# EAGLE design RHD2164_headstage1 (EAGLE 7.2.0)
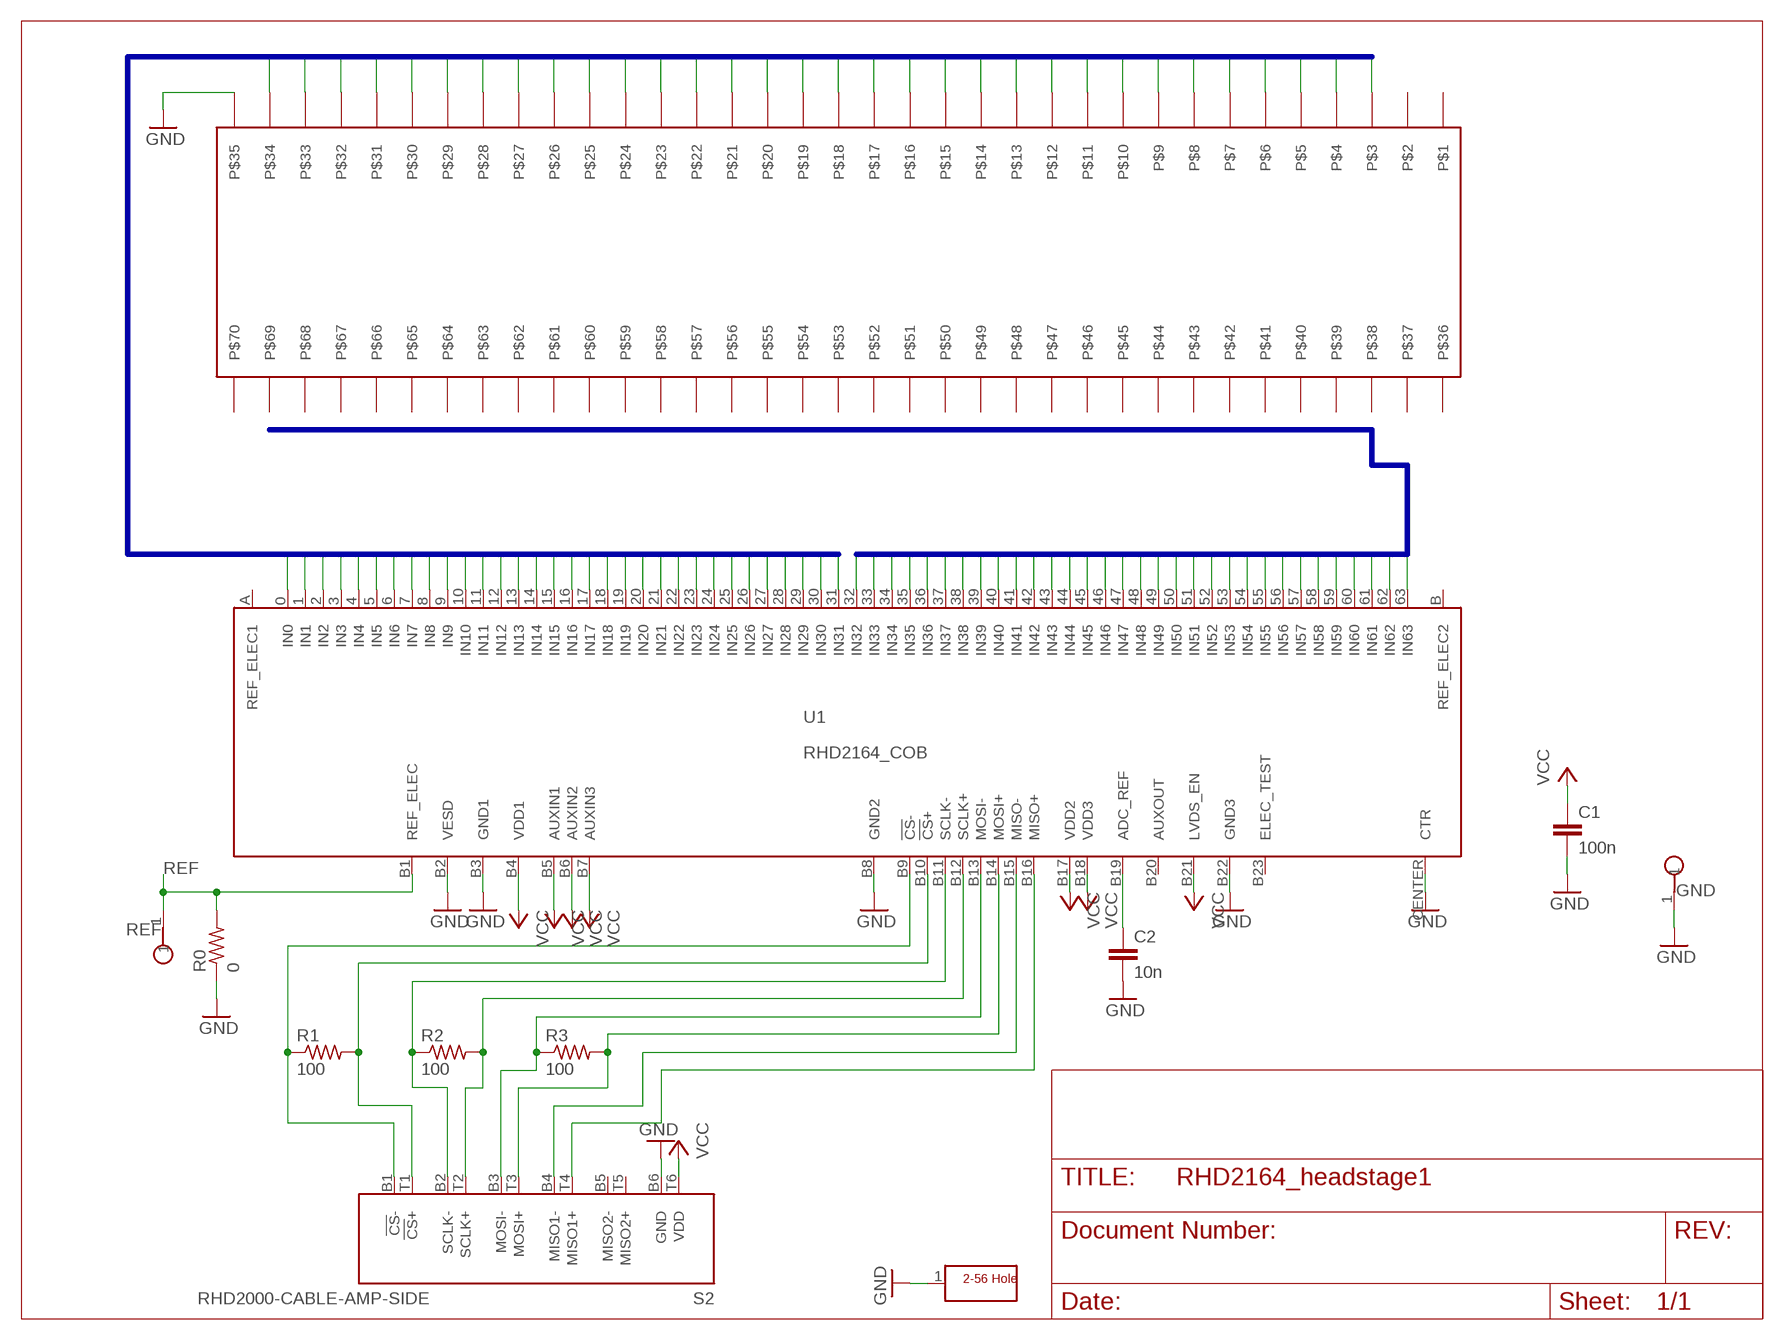
[diagram p0: schematic, sheet 1]

## Parts
C1  100n  C_0402  [0402]
C2  10n  C_0201  [0201]
GND  TESTPOINT_SMALL  [TESTPOINT_SMALL]
H1  SCREW_HOLE_2-56  [SCREW_HOLE_2-56]
R0  0  R_0402  [0402]
R1  100  R_0201  [0201]
R2  100  R_0201  [0201]
R3  100  R_0201  [0201]
REF  TESTPOINT_SMALL  [TESTPOINT_SMALL]
S2  RHD2000-CABLE-AMP-SIDE  [OMNETICS_PZN-12-AA]
U1  RHD2164_COB  [RHD2164_COB]
U$1  HIROSE_DF40_70PIN  [HIROSE_DF40C-70DS]

## Nets
A0: U1.0(IN0) U$1.P$3
A1: U1.1(IN1) U$1.P$4
A2: U1.2(IN2) U$1.P$5
A3: U1.3(IN3) U$1.P$6
A4: U1.4(IN4) U$1.P$7
A5: U1.5(IN5) U$1.P$8
A6: U1.6(IN6) U$1.P$9
A7: U1.7(IN7) U$1.P$10
A8: U1.8(IN8) U$1.P$11
A9: U1.9(IN9) U$1.P$12
A10: U1.10(IN10) U$1.P$13
A11: U1.11(IN11) U$1.P$14
A12: U1.12(IN12) U$1.P$15
A13: U1.13(IN13) U$1.P$16
A14: U1.14(IN14) U$1.P$17
A15: U1.15(IN15) U$1.P$18
A16: U1.16(IN16) U$1.P$19
A17: U1.17(IN17) U$1.P$20
A18: U1.18(IN18) U$1.P$21
A19: U1.19(IN19) U$1.P$22
A20: U1.20(IN20) U$1.P$23
A21: U1.21(IN21) U$1.P$24
A22: U1.22(IN22) U$1.P$25
A23: U1.23(IN23) U$1.P$26
A24: U1.24(IN24) U$1.P$27
A25: U1.25(IN25) U$1.P$28
A26: U1.26(IN26) U$1.P$29
A27: U1.27(IN27) U$1.P$30
A28: U1.28(IN28) U$1.P$31
A29: U1.29(IN29) U$1.P$32
A30: U1.30(IN30) U$1.P$33
A31: U1.31(IN31) U$1.P$34
B0: U1.32(IN32)
B1: U1.33(IN33)
B2: U1.34(IN34)
B3: U1.35(IN35)
B4: U1.36(IN36)
B5: U1.37(IN37)
B6: U1.38(IN38)
B7: U1.39(IN39)
B8: U1.40(IN40)
B9: U1.41(IN41)
B10: U1.42(IN42)
B11: U1.43(IN43)
B12: U1.44(IN44)
B13: U1.45(IN45)
B14: U1.46(IN46)
B15: U1.47(IN47)
B16: U1.48(IN48)
B17: U1.49(IN49)
B18: U1.50(IN50)
B19: U1.51(IN51)
B20: U1.52(IN52)
B21: U1.53(IN53)
B22: U1.54(IN54)
B23: U1.55(IN55)
B24: U1.56(IN56)
B25: U1.57(IN57)
B26: U1.58(IN58)
B27: U1.59(IN59)
B28: U1.60(IN60)
B29: U1.61(IN61)
B30: U1.62(IN62)
B31: U1.63(IN63)
GND [thick]: C1.2 C2.2 GND.1 H1.1 R0.1 S2.B6(GND) U1.B2(VESD) U1.B3(GND1) U1.B8(GND2) U1.B22(GND3) U1.CENTER(CTR) U$1.P$35
N$1: S2.T4(MISO1+) U1.B16(MISO+)
N$11: R1.1 S2.B1(!CS!-) U1.B9(!CS!-)
N$35: R1.2 S2.T1(!CS!+) U1.B10(!CS!+)
N$36: R2.1 S2.B2(SCLK-) U1.B11(SCLK-)
N$37: R2.2 S2.T2(SCLK+) U1.B12(SCLK+)
N$38: R3.1 S2.B3(MOSI-) U1.B13(MOSI-)
N$39: R3.2 S2.T3(MOSI+) U1.B14(MOSI+)
N$40: S2.B4(MISO1-) U1.B15(MISO-)
N$42 [thick]: C2.1 U1.B19(ADC_REF)
REF [thick]: R0.2 REF.1 U1.B1(REF_ELEC)
VCC [thick]: C1.1 S2.T6(VDD) U1.B4(VDD1) U1.B5(AUXIN1) U1.B6(AUXIN2) U1.B7(AUXIN3) U1.B17(VDD2) U1.B18(VDD3) U1.B21(LVDS_EN)
Unconnected: S2.B5(MISO2-) S2.T5(MISO2+) U1.A(REF_ELEC1) U1.B20(AUXOUT) U1.B23(ELEC_TEST) U1.B(REF_ELEC2) U$1.P$1 U$1.P$2 U$1.P$36 U$1.P$37 U$1.P$38 U$1.P$39 U$1.P$40 U$1.P$41 U$1.P$42 U$1.P$43 U$1.P$44 U$1.P$45 U$1.P$46 U$1.P$47 U$1.P$48 U$1.P$49 U$1.P$50 U$1.P$51 U$1.P$52 U$1.P$53 U$1.P$54 U$1.P$55 U$1.P$56 U$1.P$57 U$1.P$58 U$1.P$59 U$1.P$60 U$1.P$61 U$1.P$62 U$1.P$63 U$1.P$64 U$1.P$65 U$1.P$66 U$1.P$67 U$1.P$68 U$1.P$69 U$1.P$70

## Buses
A[0..31]
B[0..31]

## Library data of the parts
C1 C2 = RHD2000_eval_board:C: Capacitor
GND REF = RHD2000_eval_board:TESTPOINT: PCB Test Point
H1 = RHD2000_eval_board:SCREW_HOLE_2-56: Mounting hole
R0 R1-R3 = RHD2000_eval_board:R: Resistor
S2 = RHD2000:RHD2000-CABLE-AMP-SIDE
U1 = RHD2000:RHD2164
U$1 = GG_hirose70:HIROSE_DF40_70PIN

## Net classes
1 thick: width 0.102 mm
2 power: width 0.61 mm

## Board
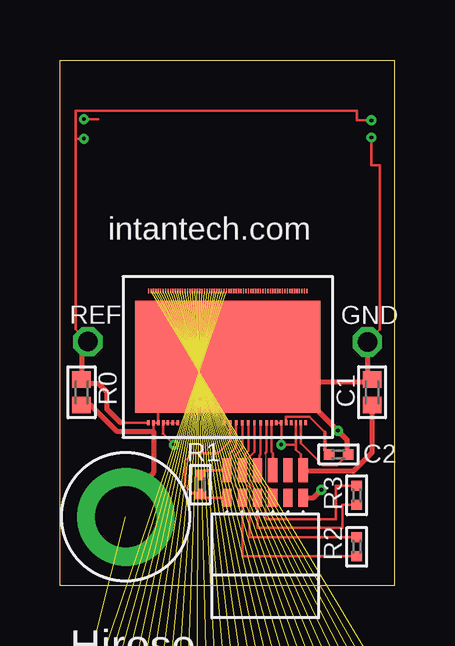
[diagram p1: board, top side]
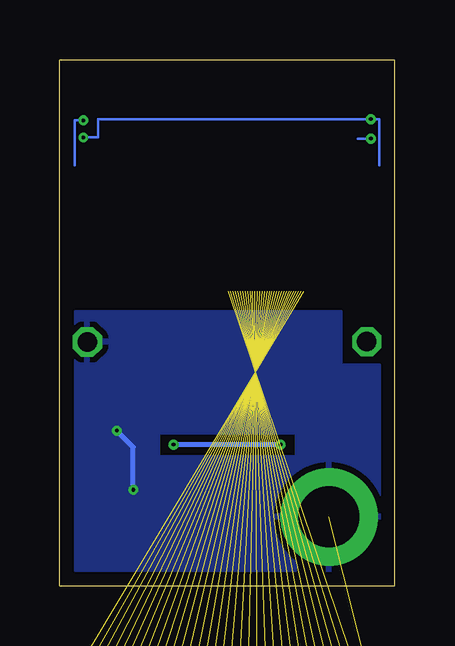
[diagram p2: board, bottom side, seen from below]

Size 13.97 x 21.91 mm. Coordinates in mm from the lower left corner, seen from the top.
Outline: 0,0 0,21.91 13.97,21.91 13.97,0 0,0
Copper layers (1*16): Top 0.035mm / dielectric 1.5mm / Bottom 0.035mm
Design rules "default": minimum track width 2mil, minimum drill 6mil, track to track 2mil, track to pad 2mil, pad to pad 2mil, via to via 2mil, smd to smd 2mil, copper to edge 20mil, drill to drill 15mil, minimum pad ring 5mil, minimum via ring 5mil, stop-mask expansion 2mil, vias tented up to drill 0mil, thermal gap 10mil
tRestrict: area 6.9,6.6 to 7,6.9; area 7.2,6.6 to 7.3,6.9; area 7.5,6.6 to 7.5,6.9; area 7.7,6.6 to 7.8,6.9; area 8,6.6 to 8,6.9; area 8.2,6.6 to 8.3,6.9

### Footprints (pad centres in the part's own frame; a part is rotated, then mirrored left to right if it is on the bottom)
0402 = smd 0.686 x 0.762: 1 -0.533,0; 2 0.533,0
0201 = smd 0.432 x 0.432: 1 -0.394,0; 2 0.394,0
TESTPOINT_SMALL = drill 0.813 octagon: 1 0,0
SCREW_HOLE_2-56 = drill 2.54 pad 4.064: 1 0,0
OMNETICS_PZN-12-AA = smd 0.381 x 0.762: B1 1.587,-1.016; B2 0.953,-1.016; B3 0.318,-1.016; B4 -0.318,-1.016; B5 -0.953,-1.016; B6 -1.587,-1.016 | smd 0.381 x 1.016: T1 1.587,-2.159; T2 0.953,-2.159; T3 0.318,-2.159; T4 -0.318,-2.159; T5 -0.953,-2.159; T6 -1.587,-2.159
RHD2164_COB = smd 0.051 x 0.203: 0 -3.2,2.743; 1 -3.099,2.743; 2 -2.997,2.743; 3 -2.896,2.743; 4 -2.794,2.743; 5 -2.692,2.743; 6 -2.591,2.743; 7 -2.489,2.743; 8 -2.388,2.743; 9 -2.286,2.743; 10 -2.184,2.743; 11 -2.083,2.743; 12 -1.981,2.743; 13 -1.88,2.743; 14 -1.778,2.743; 15 -1.676,2.743; 16 -1.575,2.743; 17 -1.473,2.743; 18 -1.372,2.743; 19 -1.27,2.743; 20 -1.168,2.743; 21 -1.067,2.743; 22 -0.965,2.743; 23 -0.864,2.743; 24 -0.762,2.743; 25 -0.66,2.743; 26 -0.559,2.743; 27 -0.457,2.743; 28 -0.356,2.743; 29 -0.254,2.743; 30 -0.152,2.743; 31 -0.051,2.743; 32 0.051,2.743; 33 0.152,2.743; 34 0.254,2.743; 35 0.356,2.743; 36 0.457,2.743; 37 0.559,2.743; 38 0.66,2.743; 39 0.762,2.743; 40 0.864,2.743; 41 0.965,2.743; 42 1.067,2.743; 43 1.168,2.743; 44 1.27,2.743; 45 1.372,2.743; 46 1.473,2.743; 47 1.575,2.743; 48 1.676,2.743; 49 1.778,2.743; 50 1.88,2.743; 51 1.981,2.743; 52 2.083,2.743; 53 2.184,2.743; 54 2.286,2.743; 55 2.388,2.743; 56 2.489,2.743; 57 2.591,2.743; 58 2.692,2.743; 59 2.794,2.743; 60 2.896,2.743; 61 2.997,2.743; 62 3.099,2.743; 63 3.2,2.743; A -3.302,2.743; B 3.302,2.743 | smd 0.102 x 0.203: B1 -3.302,-2.743; B2 -3.099,-2.743; B3 -2.896,-2.743; B4 -2.692,-2.743; B5 -2.489,-2.743; B6 -2.286,-2.743; B7 -2.083,-2.743; B8 -0.152,-2.743; B9 0.102,-2.743; B10 0.356,-2.743; B11 0.61,-2.743; B12 0.864,-2.743; B13 1.118,-2.743; B14 1.372,-2.743; B15 1.626,-2.743; B16 1.829,-2.743; B17 2.032,-2.743; B18 2.235,-2.743; B19 2.438,-2.743; B20 2.642,-2.743; B21 2.845,-2.743; B22 3.048,-2.743; B23 3.251,-2.743 | smd 7.722 x 4.674: CENTER 0,0
HIROSE_DF40C-70DS = smd 0.2 x 0.7: P$1 0,0; P$2 -0.4,0; P$3 -0.8,0; P$4 -1.2,0; P$5 -1.6,0; P$6 -2,0; P$7 -2.4,0; P$8 -2.8,0; P$9 -3.2,0; P$10 -3.6,0; P$11 -4,0; P$12 -4.4,0; P$13 -4.8,0; P$14 -5.2,0; P$15 -5.6,0; P$16 -6,0; P$17 -6.4,0; P$18 -6.8,0; P$19 -7.2,0; P$20 -7.6,0; P$21 -8,0; P$22 -8.4,0; P$23 -8.8,0; P$24 -9.2,0; P$25 -9.6,0; P$26 -10,0; P$27 -10.4,0; P$28 -10.8,0; P$29 -11.2,0; P$30 -11.6,0; P$31 -12,0; P$32 -12.4,0; P$33 -12.8,0; P$34 -13.2,0; P$35 -13.6,0; P$36 0,-3.08; P$37 -0.42,-3.08; P$38 -0.82,-3.08; P$39 -1.22,-3.08; P$40 -1.62,-3.08; P$41 -2.02,-3.08; P$42 -2.42,-3.08; P$43 -2.82,-3.08; P$44 -3.22,-3.08; P$45 -3.62,-3.08; P$46 -4.02,-3.08; P$47 -4.42,-3.08; P$48 -4.82,-3.08; P$49 -5.22,-3.08; P$50 -5.62,-3.08; P$51 -6.02,-3.08; P$52 -6.42,-3.08; P$53 -6.82,-3.08; P$54 -7.22,-3.08; P$55 -7.62,-3.08; P$56 -8.02,-3.08; P$57 -8.42,-3.08; P$58 -8.82,-3.08; P$59 -9.22,-3.08; P$60 -9.62,-3.08; P$61 -10.02,-3.08; P$62 -10.42,-3.08; P$63 -10.82,-3.08; P$64 -11.22,-3.08; P$65 -11.62,-3.08; P$66 -12.02,-3.08; P$67 -12.42,-3.08; P$68 -12.82,-3.08; P$69 -13.22,-3.08; P$70 -13.62,-3.08

### Placement (x,y rotation side)
C1  13.02,8.06 90 top
C2  11.62,5.47 0 top
GND  12.83,10.16 0 top
H1  2.74,2.87 0 top
R0  0.9,8.06 90 top
R1  5.85,4.22 90 top
R2  12.38,1.63 90 top
R3  12.38,3.77 90 top
REF  1.17,10.17 0 top
S2  8.56,2.65 180 top
U1  7,9.54 0 top
U$1  14.53,-4.32 0 top  (outside the outline)

### Tracks (layer width: path | path; a pad name or v marks a point on that pad's centre or on a via)
A0  (1 unrouted)
A1  (1 unrouted)
A2  (1 unrouted)
A3  (1 unrouted)
A4  (1 unrouted)
A5  (1 unrouted)
A6  (1 unrouted)
A7  (1 unrouted)
A8  (1 unrouted)
A9  (1 unrouted)
A10  (1 unrouted)
A11  (1 unrouted)
A12  (1 unrouted)
A13  (1 unrouted)
A14  (1 unrouted)
A15  (1 unrouted)
A16  (1 unrouted)
A17  (1 unrouted)
A18  (1 unrouted)
A19  (1 unrouted)
A20  (1 unrouted)
A21  (1 unrouted)
A22  (1 unrouted)
A23  (1 unrouted)
A24  (1 unrouted)
A25  (1 unrouted)
A26  (1 unrouted)
A27  (1 unrouted)
A28  (1 unrouted)
A29  (1 unrouted)
A30  (1 unrouted)
A31  (1 unrouted)
GND  (via drill 0.15)  (1 unrouted)
  Top 0.102: v1,19.44 1.59,19.44 | v12.99,18.68 12.99,17.53 13.35,17.53 13.35,10.68 GND.1 | 7,7.53 7,7.66 | 7,7.66 U1.CENTER | U1.B8 6.84,7.56 6.87,7.53 | 12.83,8.79 C1.2 13.02,8.47 | 3.9,6.44 U1.B2 U1.B3 4.1,7.28 4.13,7.3 6.64,7.3 6.87,7.53 | U1.B22 10.05,5.93 10.96,5.02 11.56,5.02 C2.2 11.98,5.51 | 9.59,8.47 9.34,8.47 8.52,7.66 7,7.66 | 6.87,7.53 7,7.66 | 2.74,3.56 2.73,3.54
  Top 0.203: GND.1 12.83,8.79 | 13.02,8.47 9.59,8.47 v11.6,6.46 11.98,6.08 11.98,5.51 | R0.1 1.28,7.53 2.38,6.44 3.9,6.44 3.9,4.71 2.74,3.56 H1.1 | S2.B6 10.58,3.67 v10.91,4
  Bottom 0.051: v12.99,18.68 12.39,18.68
  Bottom 0.102: 0.65,17.53 0.65,19.44 v1,19.44 12.38,19.44 12.38,18.68 v12.99,18.68
  Bottom 0.203: v10.91,4 10.91,5.78 v11.6,6.46
  pour Bottom: 0.64,0.64 0.64,9.21 2.22,9.21 2.22,11.43 13.34,11.43 13.34,0.64 9.84,0.64 9.84,6.35 4.13,6.35 4.13,0.64
  pour Bottom: 4.13,0.64 4.13,5.4 9.84,5.4 9.84,0.64
N$1
  Top 0.102: U1.B16 8.83,5.58 8.88,5.52 S2.T4
N$11
  Top 0.102: S2.B1 6.01,3.67 R1.1 5.83,3.85 5.52,3.85 5.22,4.15 5.22,5.22 5.52,5.52 6.59,5.52 7.1,6.03 U1.B9
N$35
  Top 0.102: R1.2 6.06,4.81 S2.T1 7.1,4.94 7.1,5.52 7.35,5.78 U1.B10
N$36
  Top 0.051: 7.3,5.42 7.3,4.18 7.61,3.87 S2.B2
  Top 0.102: U1.B11 7.61,5.73 7.3,5.42 | S2.B2 7.61,1.23 R2.1
N$37
  Top 0.051: S2.T2 7.61,4.41 7.91,4.1 7.91,3.09
  Top 0.102: U1.B12 7.86,5.63 7.71,5.47 7.71,4.92 S2.T2 | 7.91,3.09 7.91,2.02 R2.2
N$38
  Top 0.051: 7.91,5.37 7.91,4.25 8.24,3.92 S2.B3 8.24,3.82
  Top 0.102: U1.B13 8.12,5.58 7.91,5.37 | S2.B3 8.24,2.43 11.77,2.43 11.77,3.38 R3.1
N$39
  Top 0.051: S2.T3 8.24,4.43 8.57,4.1 8.57,3.14
  Top 0.102: U1.B14 8.37,5.47 8.32,5.42 8.32,4.89 S2.T3 | 8.57,3.14 8.57,2.78 11.52,2.78 11.52,4.17 R3.2
N$40
  Top 0.051: 8.57,5.52 8.57,4.25 8.88,3.95 S2.B4 8.88,3.85
  Top 0.102: U1.B15 8.62,5.58 8.57,5.52
N$42
  Top 0.102: U1.B19 9.44,7.05 10.4,7.05 11.06,6.39 | 11.06,5.64 C2.1
  Top 0.152: 11.06,6.39 11.06,5.64
REF  (via drill 0.15)
  Top 0.102: 0.65,18.63 0.65,19.8 12.38,19.8 12.38,19.39 v12.99,19.39 | 0.65,18.63 0.65,17.53 0.65,10.69 REF.1 | v1,18.63 0.65,18.63 | U1.B1 2.53,6.79 | 1.08,8.42 R0.2
  Top 0.203: REF.1 0.9,9.91 R0.2 | 2.53,6.79 1.97,7.35 1.97,8.06 1.61,8.42 1.08,8.42
  Bottom 0.102: 1.55,18.63 v1,18.63 | 13.35,17.53 13.35,19.39 v12.99,19.39
VCC  (via drill 0.15)
  Top 0.051: U1.B4 U1.B5 U1.B6 U1.B7
  Top 0.102: U1.B17 U1.B18 v9.23,5.88 9.84,5.88 | U1.B21 9.84,5.88 | 9.84,5.88 9.84,5.68 10.05,5.47 10.05,4.92 S2.T6 10.2,4.76 | U1.B4 4.3,6.34 v4.76,5.88
  Top 0.203: C1.1 13.02,5.55 12.23,4.76 10.2,4.76
  Bottom 0.203: v4.76,5.88 v9.23,5.88

### Text on the board
tPlace: intantech.com